# Altium schematic sheet POWER.SchDoc
size A4; SheetNumber: 3; SheetTotal: 5
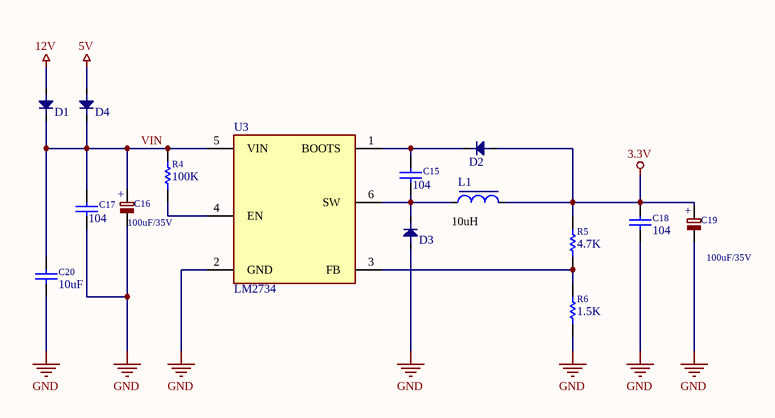
[diagram p0: POWER.SchDoc]

## Parts
C15  104  [C2012-0805]
C16  100uF/35V  [CAP_100/35V]
C17  104  [C2012-0805]
C18  104  [C2012-0805]
C19  100uF/35V  [CAP_100/35V]
C20  10uF  [C1210]
D1  SS34  [DO-214AC,SMA]  (value not drawn)
D2  SS34  [DO-214AC,SMA]  (value not drawn)
D3  SS34  [DO-214AC,SMA]  (value not drawn)
D4  SS34  [DO-214AC,SMA]  (value not drawn)
L1  10uH  [L-6030]
R4  value 100K  [R2012-0805]  (hidden comment: 4.7K)
R5  4.7K  [R2012-0805]
R6  1.5K  [R2012-0805]
U3  LM2734  [SOT23-6]

## Nets
3.3V: C18.1 C19.1(+) D2.1(A) L1.2 R5.2
5V: D4.1(A)
12V: D1.1(A)
GND: C16.2(-) C17.2 C18.2 C19.2(-) C20.2 D3.1(A) R6.1 U3.2(GND)
VIN: C16.1(+) C17.1 C20.1 D1.2(K) D4.2(K) R4.2 U3.5(VIN)
NetC15_1: C15.1 D2.2(K) U3.1(BOOTS)
NetC15_2: C15.2 D3.2(K) L1.1 U3.6(SW)
NetR4_1: R4.1 U3.4(EN)
NetR5_1: R5.1 R6.2 U3.3(FB)

## Library data of the parts
C15 C17 C18 C20 = Cap <SMD>: Capacitor; AEMS Code: 2100341; Vendor: Digikey; Volt: 16V; Published: 13-April-2009; Publisher: Hoang Nguyen; ComponentLink1Description: Digikey Part Link; ComponentLink2Description: Open Datasheet; ComponentLink2URL: H:\LIBRARY\LIBRARY.Datasheet\
  C15 C17 C18: Value: 104
  C20: Value: 10uF
C16 C19 = Cap_Pol <DIP>: Polarized Capacitor; Manufacturer: FARNELL; AEMS Code: 2100110; Vendor: Digikey; Capacitor Type: Cap Pol Dip; Published: 13-April-2009; Publisher: Hoang Nguyen; ComponentLink1Description: Digikey Part Link; ComponentLink2Description: Open Datasheet; ComponentLink2URL: H:\LIBRARY\LIBRARY.Datasheet\
D1-D4 = Didode_Smd: Vendor: Digikey; Value: FR307; Current: 3Amp; Published: 8-Jun-2000; LatestRevisionDate: 17-Jul-2002; LatestRevisionNote: Re-released for DXP Platform.; DatasheetDocument: 1997; PackageReference: DO-35; Publisher: Altium Limited; Code_JEDEC: DO-204-AH; ComponentLink1Description: Digikey Part Link; ComponentLink1URL: http://www.fairchildsemi.com/; ComponentLink2Description: Open Datasheet; ComponentLink2URL: H:\LIBRARY\LIBRARY.Datasheet\ds26003.pdf
L1 = Inductor Ferrite: Smd Inductors; Code_IEC: 1005; Vendor: Digikey; Published: 8-Jun-2000; LatestRevisionDate: 17-Jul-2002; LatestRevisionNote: Re-released for DXP Platform.; PackageReference: 0402-A; Publisher: Altium Limited; Code_JEITA: 0402; ComponentLink1Description: Digikey Part Link; ComponentLink2Description: Open Datasheet; ComponentLink2URL: H:\LIBRARY\LIBRARY.Datasheet\; Value: 10uH
R4-R6 = Resistor <SMD>: Resistor; AEMS Code: 1200430; Vendor: Digikey; Tollerance: 5%; Published: 17-3-2009; Publisher: Hoang Nguyen; ComponentLink1Description: Digikey Part Link; ComponentLink2Description: Open Datasheet; ComponentLink2URL: H:\LIBRARY\LIBRARY.Datasheet\
  R5: Value: 4.7K
  R6: Value: 1.5K
U3 = LM2734: Step-Down DC-DC Regulator